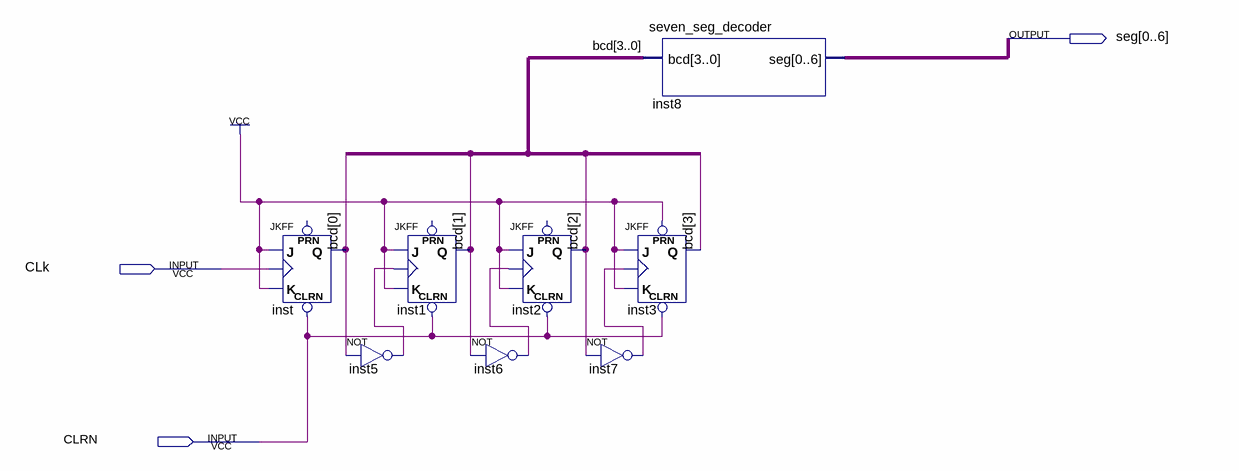
[diagram p0: schematic sheet]
// Quartus schematic lab10step3a.bdf as structural Verilog: 8 symbols, 3 pins
module lab10step3a (
  input  CLk,
  input  CLRN,
  output [0:6] seg
);

  wire inst5_out, inst6_out, inst7_out;
  wire [3:0] bcd;

  JKFF inst (.CLRN(CLRN), .K(1'b1), .J(1'b1), .CLK(CLk), .Q(bcd[0]));  // open: PRN
  not inst5 (inst5_out, bcd[0]);
  JKFF inst1 (.CLRN(CLRN), .K(1'b1), .J(1'b1), .CLK(inst5_out), .Q(bcd[1]));  // open: PRN
  JKFF inst2 (.CLRN(CLRN), .K(1'b1), .J(1'b1), .CLK(inst6_out), .Q(bcd[2]));  // open: PRN
  not inst6 (inst6_out, bcd[1]);
  not inst7 (inst7_out, bcd[2]);
  seven_seg_decoder inst8 (.bcd(bcd), .seg(seg));
  JKFF inst3 (.PRN(1'b1), .CLRN(CLRN), .K(1'b1), .J(1'b1), .CLK(inst7_out), .Q(bcd[3]));
endmodule
